# Altium project MMC_2_2.PrjPcb
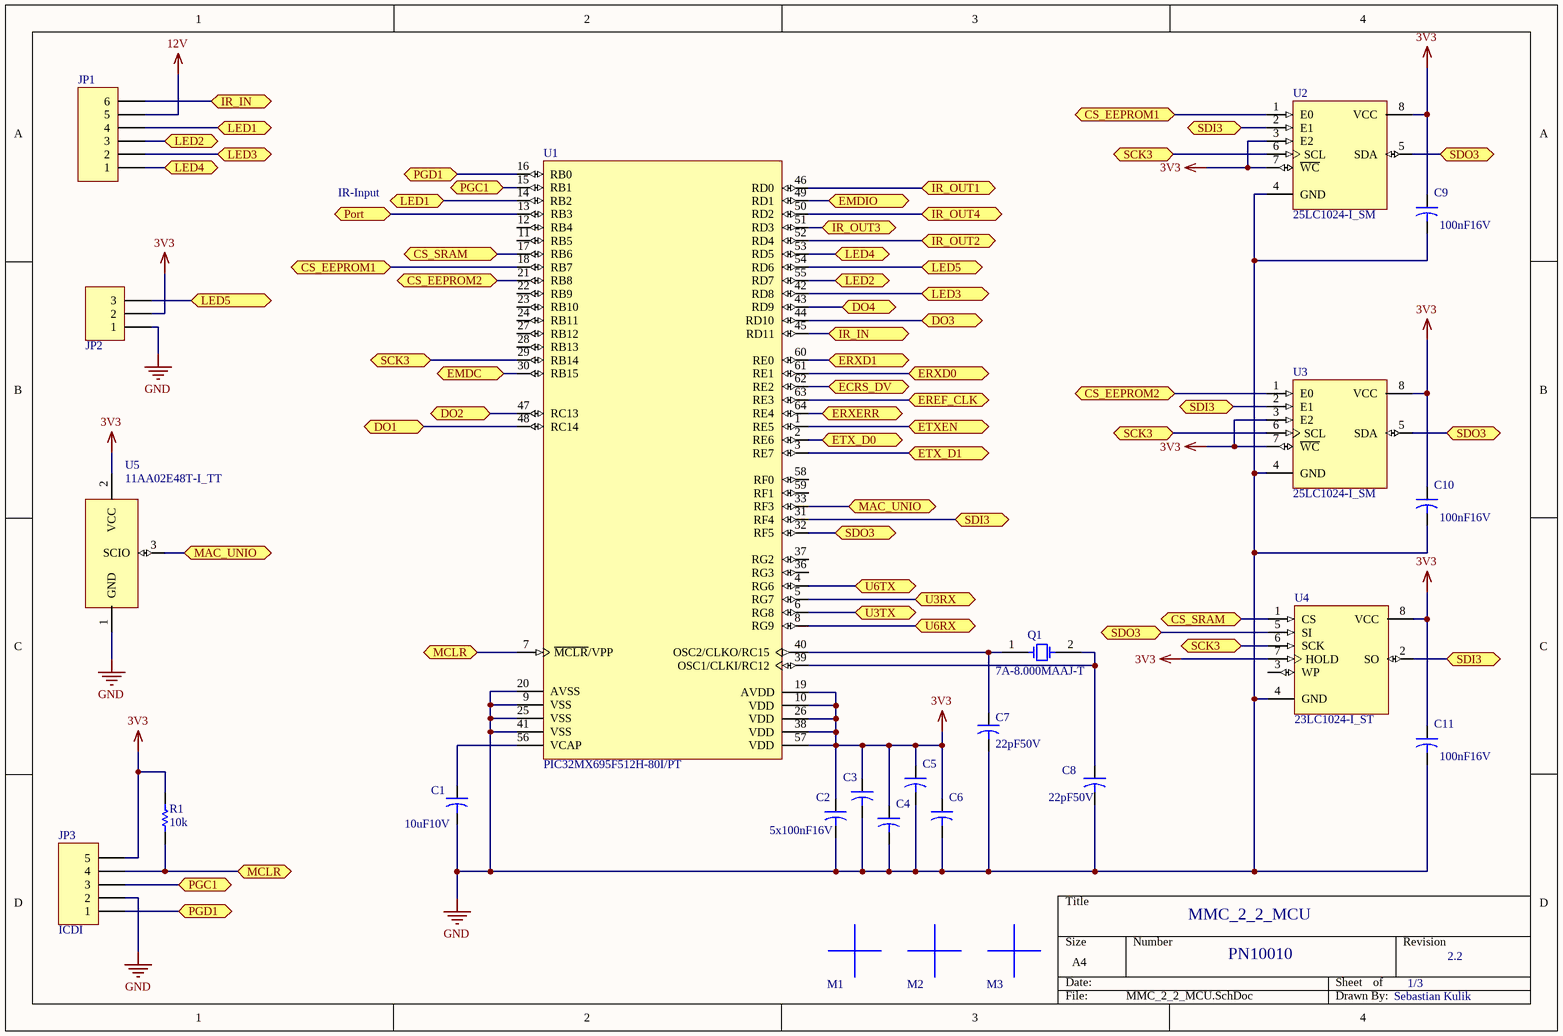
[diagram p0: MMC_2_2_MCU.SchDoc]
3 sheets, 83 parts. Net scope: flat (ports and power ports of the same name join across sheets).
Board file: MMC_2_2.PcbDoc
Sheets:
  MMC_2_2_MCU.SchDoc
  MMC_2_2_Ethernet.SchDoc
  MMC_2_2_PSU.SchDoc

## Sheet MMC_2_2_MCU.SchDoc
size A4

### Parts
C1  value 10uF10V  [C0603]  (hidden comment: 10uF10V_0603)
C2  100nF16V_0402  [C0402]  (value not drawn)
C3  100nF16V_0402  [C0402]  (value not drawn)
C4  100nF16V_0402  [C0402]  (value not drawn)
C5  100nF16V_0402  [C0402]  (value not drawn)
C6  100nF16V_0402  [C0402]  (value not drawn)
C7  value 22pF50V  [C0402]  (hidden comment: 22pF50V_0402)
C8  value 22pF50V  [C0402]  (hidden comment: 22pF50V_0402)
C9  value 100nF16V  [C0402]  (hidden comment: 100nF16V_0402)
C10  value 100nF16V  [C0402]  (hidden comment: 100nF16V_0402)
C11  value 100nF16V  [C0402]  (hidden comment: 100nF16V_0402)
JP1  Header 6_2.54  [HDR1X6_2.54]  (value not drawn)
JP2  Header-3  [HDR1X3]  (value not drawn)
JP3  ICDI  [HDR1X5-1.27]
M1  Mark  [Mark-3mm]  (value not drawn)
M2  Mark  [Mark-3mm]  (value not drawn)
M3  Mark  [Mark-3mm]  (value not drawn)
Q1  7A-8.000MAAJ-T  [TXC_7A]
R1  value 10k  [R0402]  (hidden comment: 10k_0402)
U1  PIC32MX695F512H-80I/PT  [TQFP-64_N1]
U2  25LC1024-I_SM  [SOP8_N]
U3  25LC1024-I_SM  [SOP8_N]
U4  23LC1024-I_ST  [TSSOP8]
U5  11AA02E48T-I_TT  [SOT23_M]

### Ports
CS_EEPROM1, CS_EEPROM2, CS_SRAM, DO1, DO2, DO3, DO4, ECRS_DV, EMDC, EMDIO, EREF_CLK, ERXD0, ERXD1, ERXERR, ETX_D0, ETX_D1, ETXEN, IR_IN, IR_OUT1, IR_OUT2, IR_OUT3, IR_OUT4, LED1, LED2, LED3, LED4, LED5, MAC_UNIO, MCLR, PGC1, PGD1, Port, SCK3, SDI3, SDO3, U3RX, U3TX, U6RX, U6TX

### Nets
3V3: C2.1 C3.1 C4.1 C5.1 C6.1 C9.1 C10.1 C11.1 JP2.2 JP3.5 R1.2 U1.10(VDD) U1.19(AVDD) U1.26(VDD) U1.38(VDD) U1.57(VDD) U2.3(E2) U2.7(~{WC}) U2.8(VCC) U3.3(E2) U3.7(~{WC}) U3.8(VCC) U4.7(HOLD) U4.8(VCC) U5.2(VCC)
12V: JP1.5
GND: C1.2 C2.2 C3.2 C4.2 C5.2 C6.2 C7.2 C8.2 C9.2 C10.2 C11.2 JP2.1 JP3.2 U1.9(VSS) U1.20(AVSS) U1.25(VSS) U1.41(VSS) U2.4(GND) U3.4(GND) U4.4(GND) U5.1(GND)
NetC1_1: C1.1 U1.56(VCAP)
NetC7_1: C7.1 Q1.1(E/D) U1.40(OSC2/CLKO/RC15)
NetC8_1: C8.1 Q1.2(GND) U1.39(OSC1/CLKI/RC12)
NetJP1_1: JP1.1 U1.53(RD5) ; port LED4
NetJP1_2: JP1.2 U1.42(RD8) ; port LED3
NetJP1_3: JP1.3 U1.55(RD7) ; port LED2
NetJP1_4: JP1.4 U1.14(RB2) ; port LED1
NetJP1_6: JP1.6 U1.45(RD11) ; port IR_IN
NetJP2_3: JP2.3 U1.54(RD6) ; port LED5
NetJP3_1: JP3.1 U1.16(RB0) ; port PGD1
NetJP3_3: JP3.3 U1.15(RB1) ; port PGC1
NetJP3_4: JP3.4 R1.1 U1.7(~{MCLR}/VPP) ; port MCLR
NetR2_2: U1.63(RE3) ; port EREF_CLK
NetR13_1: U1.49(RD1) ; port EMDIO
NetR15_2: U1.60(RE0) ; port ERXD1
NetR16_2: U1.61(RE1) ; port ERXD0
NetR17_2: U1.64(RE4) ; port ERXERR
NetR18_2: U1.62(RE2) ; port ECRS_DV
NetU1_1: U1.1(RE5) ; port ETXEN
NetU1_2: U1.2(RE6) ; port ETX_D0
NetU1_3: U1.3(RE7) ; port ETX_D1
NetU1_4: U1.4(RG6) ; port U6TX
NetU1_5: U1.5(RG7) ; port U3RX
NetU1_6: U1.6(RG8) ; port U3TX
NetU1_8: U1.8(RG9) ; port U6RX
NetU1_13: U1.13(RB3) ; port Port
NetU1_17: U1.17(RB6) U4.1(CS) ; port CS_SRAM
NetU1_18: U1.18(RB7) U2.1(E0) ; port CS_EEPROM1
NetU1_21: U1.21(RB8) U3.1(E0) ; port CS_EEPROM2
NetU1_29: U1.29(RB14) U2.6(SCL) U3.6(SCL) U4.6(SCK) ; port SCK3
NetU1_30: U1.30(RB15) ; port EMDC
NetU1_31: U1.31(RF4) U2.2(E1) U3.2(E1) U4.2(SO) ; port SDI3
NetU1_32: U1.32(RF5) U2.5(SDA) U3.5(SDA) U4.5(SI) ; port SDO3
NetU1_33: U1.33(RF3) U5.3(SCIO) ; port MAC_UNIO
NetU1_43: U1.43(RD9) ; port DO4
NetU1_44: U1.44(RD10) ; port DO3
NetU1_46: U1.46(RD0) ; port IR_OUT1
NetU1_47: U1.47(RC13) ; port DO2
NetU1_48: U1.48(RC14) ; port DO1
NetU1_50: U1.50(RD2) ; port IR_OUT4
NetU1_51: U1.51(RD3) ; port IR_OUT3
NetU1_52: U1.52(RD4) ; port IR_OUT2

Not connected (* = marked no-connect by the designer): U1 11(RB5) 12(RB4) 22(RB9) 23(RB10) 24(RB11) 27(RB12) 28(RB13) 36(RG3) 37(RG2) 58(RF0) 59(RF1); U4 3(WP)

### Notes on the sheet
- IR-Input
- (near C2) 5x100nF16V
- MMC_2_2_MCU
- PN10010
- 1/3
- 2.2
- Sebastian Kulik

### Library data of the parts
C1 = 10uF10V_0603: Capacitor; Part Description: AVX ,  X5R, 20%, 10V; Deliverer PartNr: 1867954RL; Manufacturer: AVX; Manufacturer PartNr: 0603ZD106MAT2A; Deliverer: Farnell; TDFE-PN: C0016; Published: 11.02.2014; Publisher: Sebastian Kulik; PackageDescription: C0603
C2-C6 C9-C11 = 100nF16V_0402: Capacitor; Part Description: TDK. CGA series, X7R, 10%, 16V; Deliverer PartNr: 2210748RL; Manufacturer: TDK; Manufacturer PartNr: CGA2B1X7R1C104K050BC; Deliverer: Farnell; TDFE-PN: C0025; Published: 12.02.2014; Publisher: Sebastian Kulik; PackageDescription: C0403
  C2-C6: Value: 100nF16V
C7 C8 = 22pF50V_0402: Murata, GRM series, 50V; Deliverer PartNr: 8819629RL; Manufacturer PartNr: GRM1555C1H220JZ01D; Deliverer: Farnell; TDFE-PN: C0021; Published: 11.02.2014; Part Description: Murata, GRM series, 50V; Publisher: Sebastian Kulik; PackageDescription: C0403; Manufacturer: Murata
JP1 = Header 6_2.54: Header, 6-Pin; LatestRevisionDate: 17-Jul-2002; LatestRevisionNote: Re-released for DXP Platform.; Publisher: Altium Limited
JP2 = Header-3: Header-3-Pin; Publisher: Sebastian Kulik
JP3 = ICDI: Header, 5-Pin; LatestRevisionDate: 17-Jul-2002; LatestRevisionNote: Re-released for DXP Platform.; Publisher: Sebastian Kulik
Q1 = Crystal_8MHz: Crystal, 7A-8.000MAAJ-T; Deliverer PartNr: 1892148; Manufacturer: TXC; Deliverer: Farnell; TDE-PN: P0003; Published: 14.02.2014; PackageReference: 7A; Publisher: Sebastian Kulik; Manufacturer PartNr: 7A-8.000MAAJ-T
R1 = 10k_0402: Vishay CRCW series, 125mW, 1%; Manufacturer PartNr: CRCW040210K0FKEAHP; Deliverer PartNr: 1738864; TDE-PN: R0012; Deliverer: Farnell; Published: 12.02.2014; PackageReference: 0402; Publisher: Sebastian Kulik; PackageDescription: 0402; Manufacturer: Vishay; Part Description: Vishay CRCW series, 125mW, 1%
U1 = PIC32MX695F512H-80I/PT: High Performance ROM-less Microcontroller with External Memory Bus, 1.5K RAM, 64-Pin TQFP, 4.2 to 5.5V Supply Range, Industrial Temperature; Deliverer PartNr: 1778975; Manufacturer: Microchip; Deliverer: Farnell; TDE-PN: IC0031; Published: 11.02.2014; PackageReference: TQFP-64; Publisher: Sebastian Kulik; PackageDescription: 64-Pin Thin Plastic Quad Flat Pack 0.5 mm Pitch, 1.0/0.1 mm Lead Form; Manufacturer PartNr: PIC32MX695F512H-80I/PT
U2 U3 = 25LC1024-I_SM: 1024 Kbit Serial SPI Bus EEPROM; Deliverer PartNr: 1331393; Manufacturer: Microchip; Deliverer: Farnell; TDE-PN: IC0033; Published: 12.02.2014; PackageReference: SOP8; Publisher: Sebastian Kulik; Manufacturer PartNr: 25LC1024-I_SM
U4 = 23LC1024-I_ST: 1 Mbit Serial  EEPROM; Deliverer PartNr: 2212151; Manufacturer PartNr: 23LC1024-I/ST; Manufacturer: Microchip; Deliverer: Farnell; TDE-PN: IC0034; Published: 12.02.2014; PackageReference: TSSOP8; Publisher: Sebastian Kulik
U5 = 11AA02E48T-I_TT: 2 kbit Serial  EEPROM; Deliverer PartNr: 1707616RL; Manufacturer PartNr: 11AA02E48T-I/TT; Manufacturer: Microchip; Deliverer: Farnell; TDE-PN: IC0035; Published: 12.02.2014; PackageReference: SOT23; Publisher: Sebastian Kulik

## Sheet MMC_2_2_Ethernet.SchDoc
size A4
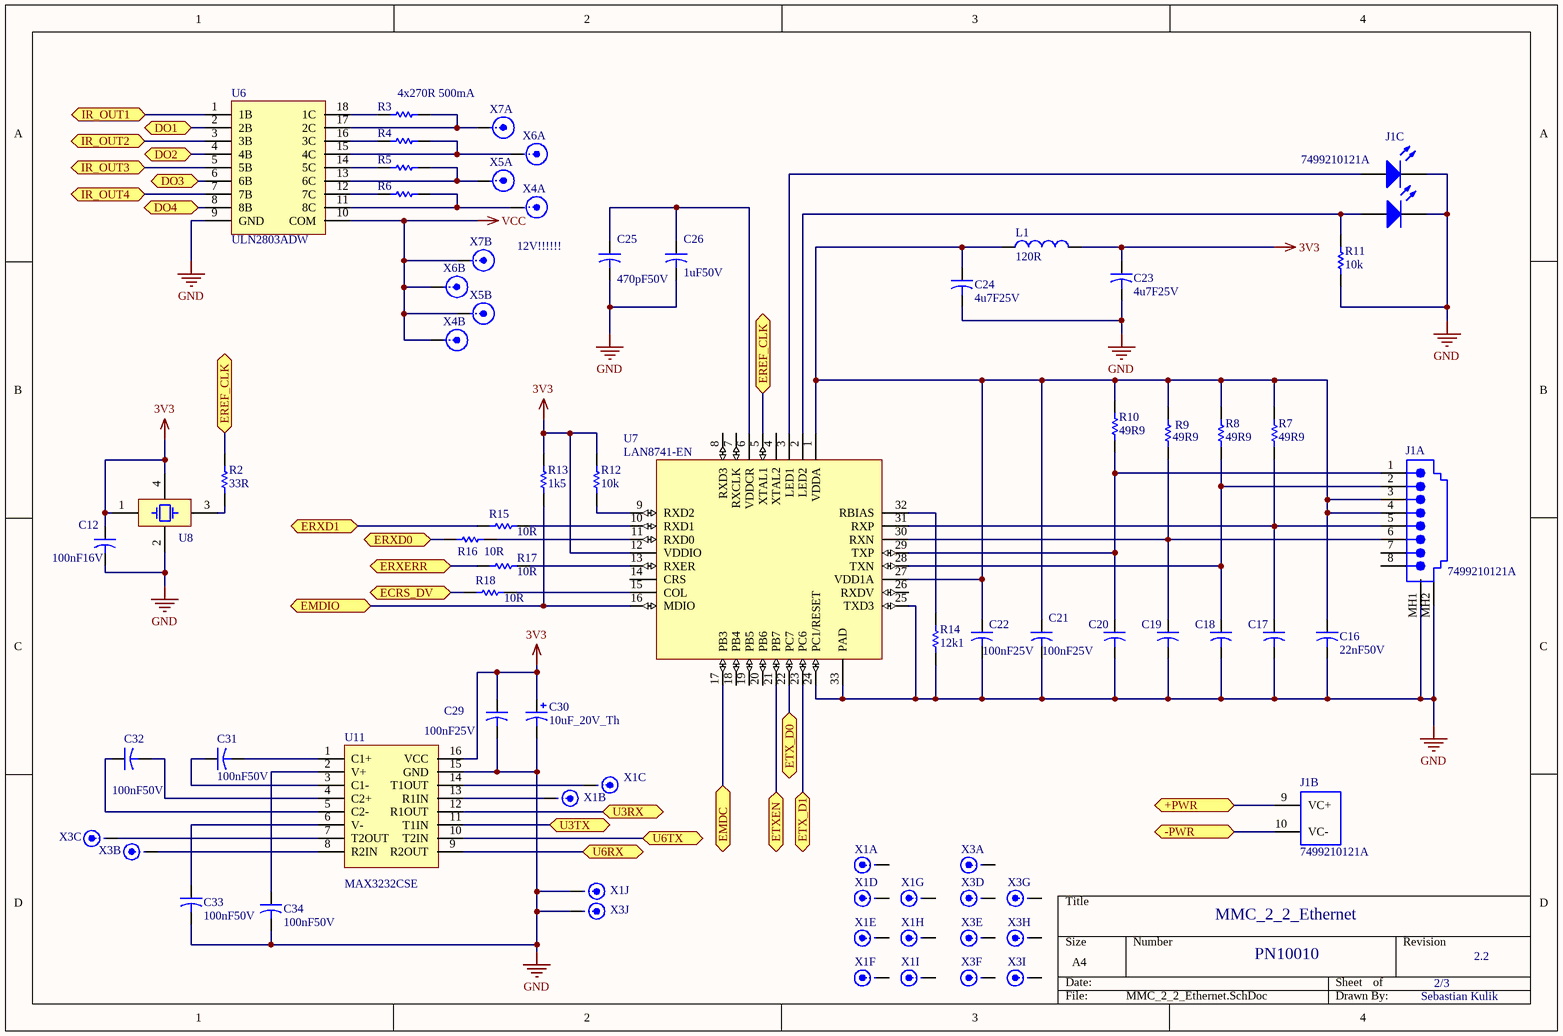
[diagram p1: MMC_2_2_Ethernet.SchDoc]

### Parts
C12  value 100nF16V  [C0402]  (hidden comment: 100nF16V_0402)
C16  value 22nF50V  [C0603]  (hidden comment: 22nF50V_0603)
C17  10pF50V_0603  [C0603]  (value not drawn)
C18  10pF50V_0603  [C0603]  (value not drawn)
C19  10pF50V_0603  [C0603]  (value not drawn)
C20  10pF50V_0603  [C0603]  (value not drawn)
C21  value 100nF25V  [C0402]  (hidden comment: 100nF25V_0402)
C22  value 100nF25V  [C0402]  (hidden comment: 100nF25V_0402)
C23  value 4u7F25V  [C0805]  (hidden comment: 4u7F25V_0805)
C24  value 4u7F25V  [C0805]  (hidden comment: 4u7F25V_0805)
C25  value 470pF50V  [C0402]  (hidden comment: 470pF50V_0402)
C26  value 1uF50V  [C0603]  (hidden comment: 1uF50V_0603)
C29  value 100nF25V  [C0402]  (hidden comment: 100nF25V_0402)
C30  value 10uF_20V_Th  [Vishay293D-B]  (hidden comment: 10uF_20V_V293D-B)
C31  value 100nF50V  [C0402]  (hidden comment: 100n50V_0402)
C32  value 100nF50V  [C0402]  (hidden comment: 100n50V_0402)
C33  value 100nF50V  [C0402]  (hidden comment: 100n50V_0402)
C34  value 100nF50V  [C0402]  (hidden comment: 100n50V_0402)
J1  7499210121A  [7499210121A]  (parts A,B,C of 3)
L1  value 120R  [L0603]  (hidden comment: 120R4A_0603)
R2  value 33R  [R0402]  (hidden comment: 33R_0402)
R3  270R_1210  [R1210_N]  (value not drawn)
R4  270R_1210  [R1210_N]  (value not drawn)
R5  270R_1210  [R1210_N]  (value not drawn)
R6  270R_1210  [R1210_N]  (value not drawn)
R7  value 49R9  [R0402]  (hidden comment: 49R9_0402)
R8  value 49R9  [R0402]  (hidden comment: 49R9_0402)
R9  value 49R9  [R0402]  (hidden comment: 49R9_0402)
R10  value 49R9  [R0402]  (hidden comment: 49R9_0402)
R11  value 10k  [R0402]  (hidden comment: 10k_0402)
R12  value 10k  [R0402]  (hidden comment: 10k_0402)
R13  value 1k5  [R0402]  (hidden comment: 1k5_0402)
R14  value 12k1  [R0603(1608)]  (hidden comment: 12k1_0603)
R15  value 10R  [R0402]  (hidden comment: 10R_0402)
R16  value 10R  [R0402]  (hidden comment: 10R_0402)
R17  value 10R  [R0402]  (hidden comment: 10R_0402)
R18  value 10R  [R0402]  (hidden comment: 10R_0402)
U6  ULN2803ADW  [SOIC18-WIDE]
U7  LAN8741-EN  [32M1-A_M]
U8  TXC-7W-50.000MBB-T  [TXC_7W]  (value not drawn)
U11  MAX3232CSE  [SOIC16_L]
X1  SUB-D_9  [M09HP]  (value not drawn)  (parts A,B,C,D,E,F,G,H,I,J of 10)
X3  SUB-D_9  [M09HP]  (value not drawn)  (parts A,B,C,D,E,F,G,H,I,J of 10)
X4  PhoenixMSTBA-2  [MSTBA 2,5_2-G-5,08-LR]  (value not drawn)  (parts A,B of 2)
X5  PhoenixMSTBA-2  [MSTBA 2,5_2-G-5,08-LR]  (value not drawn)  (parts A,B of 2)
X6  PhoenixMSTBA-2  [MSTBA 2,5_2-G-5,08-LR]  (value not drawn)  (parts A,B of 2)
X7  PhoenixMSTBA-2  [MSTBA 2,5_2-G-5,08-LR]  (value not drawn)  (parts A,B of 2)

### Ports
+PWR, -PWR, DO1, DO2, DO3, DO4, ECRS_DV, EMDC, EMDIO, EREF_CLK, ERXD0, ERXD1, ERXERR, ETX_D0, ETX_D1, ETXEN, IR_OUT1, IR_OUT2, IR_OUT3, IR_OUT4, U3RX, U3TX, U6RX, U6TX

### Nets
3V3: C12.1 C23.1 C29.1 C30.1 L1.2 R12.2 R13.2 U7.12(VDDIO) U8.1(E/D) U8.4(VCC) U11.16(VCC)
GND: C12.2 C16.2 C17.2 C18.2 C19.2 C20.2 C21.2 C22.2 C23.2 C24.2 C25.2 C26.2 C29.2 C30.2 C33.2 C34.2 J1.12(K) J1.14(K) J1.MH1(Shield) J1.MH2(Shield) R11.1 R14.1 U6.9(GND) U7.24(PC1/RESET) U7.25(TXD3) U7.33(PAD) U8.2(GND) U11.15(GND) X1.10(GND) X3.10(GND)
VCC: U6.10(COM) X4.2(Y) X5.2(Y) X6.2(Y) X7.2(Y)
NetC16_1: C16.1 C21.1 C22.1 C24.1 J1.3 J1.4 L1.1 R7.2 R8.2 R9.2 R10.2 U7.1(VDDA) U7.27(VDD1A)
NetC17_1: C17.1 J1.5 R7.1 U7.31(RXP)
NetC18_1: C18.1 J1.2 R8.1 U7.28(TXN)
NetC19_1: C19.1 J1.6 R9.1 U7.30(RXN)
NetC20_1: C20.1 J1.1 R10.1 U7.29(TXP)
NetC25_1: C25.1 C26.1 U7.6(VDDCR)
NetC31_1: C31.1 U11.3(C1-)
NetC31_2: C31.2 U11.1(C1+)
NetC32_1: C32.1 U11.5(C2-)
NetC32_2: C32.2 U11.4(C2+)
NetC33_1: C33.1 U11.6(V-)
NetC34_1: C34.1 U11.2(V+)
NetD3_1: J1.9(VC+) ; port +PWR
NetD3_2: J1.10(VC-) ; port -PWR
NetJ1_11: J1.11(A) U7.3(LED1)
NetJ1_13: J1.13(A) R11.2 U7.2(LED2)
NetR2_1: R2.1 U8.3(OSC2)
NetR2_2: R2.2 U7.5(XTAL1) ; port EREF_CLK
NetR3_1: R3.1 U6.18(1C)
NetR3_2: R3.2 U6.17(2C) X7.1(X)
NetR4_1: R4.1 U6.16(3C)
NetR4_2: R4.2 U6.15(4C) X6.1(X)
NetR5_1: R5.1 U6.14(5C)
NetR5_2: R5.2 U6.13(6C) X5.1(X)
NetR6_1: R6.1 U6.12(7C)
NetR6_2: R6.2 U6.11(8C) X4.1(X)
NetR12_1: R12.1 U7.9(RXD2)
NetR13_1: R13.1 U7.16(MDIO) ; port EMDIO
NetR14_2: R14.2 U7.32(RBIAS)
NetR15_1: R15.1 U7.10(RXD1)
NetR15_2: R15.2 ; port ERXD1
NetR16_1: R16.1 U7.11(RXD0)
NetR16_2: R16.2 ; port ERXD0
NetR17_1: R17.1 U7.13(RXER)
NetR17_2: R17.2 ; port ERXERR
NetR18_1: R18.1 U7.15(COL)
NetR18_2: R18.2 ; port ECRS_DV
NetU1_1: U7.21(PB7) ; port ETXEN
NetU1_2: U7.22(PC7) ; port ETX_D0
NetU1_3: U7.23(PC6) ; port ETX_D1
NetU1_4: U11.10(T2IN) ; port U6TX
NetU1_5: U11.12(R1OUT) ; port U3RX
NetU1_6: U11.11(T1IN) ; port U3TX
NetU1_8: U11.9(R2OUT) ; port U6RX
NetU1_30: U7.17(PB3) ; port EMDC
NetU1_43: U6.8(8B) ; port DO4
NetU1_44: U6.6(6B) ; port DO3
NetU1_46: U6.1(1B) ; port IR_OUT1
NetU1_47: U6.4(4B) ; port DO2
NetU1_48: U6.2(2B) ; port DO1
NetU1_50: U6.7(7B) ; port IR_OUT4
NetU1_51: U6.5(5B) ; port IR_OUT3
NetU1_52: U6.3(3B) ; port IR_OUT2
NetU11_7: U11.7(T2OUT) X3.3
NetU11_8: U11.8(R2IN) X3.2
NetU11_13: U11.13(R1IN) X1.2
NetU11_14: U11.14(T1OUT) X1.3

Not connected (* = marked no-connect by the designer): J1 7 8; U7 4(XTAL2) 7(RXCLK) 8(RXD3) 14(CRS) 18(PB4) 19(PB5) 20(PB6) 26(RXDV); X1 1 4 5 6 7 8 9; X3 1 4 5 6 7 8 9

### Notes on the sheet
- (near R3) 4x270R 500mA
- 12V!!!!!!
- MMC_2_2_Ethernet
- PN10010
- 2/3
- 2.2
- Sebastian Kulik

### Library data of the parts
C12 = 100nF16V_0402: as C2 on sheet MMC_2_2_MCU; Published: 12.02.2014; Publisher: Sebastian Kulik; PackageDescription: C0403
C16 = 22nF50V_0603: AVX ,  X7R, 5%, 50V; Deliverer PartNr: 2332645RL; Manufacturer PartNr: 06035C223JAT2A; Deliverer: Farnell; TDFE-PN: C0034; Published: 13.02.2014; Part Description: AVX ,  X7R, 5%, 50V; Publisher: Sebastian Kulik; PackageDescription: C0603; Manufacturer: AVX
C17-C20 = 10pF50V_0603: AVX ,  +-0.5pF, 50V; Deliverer PartNr: 2332595RL; Manufacturer PartNr: 06035A100DAT2A; Deliverer: Farnell; TDFE-PN: C0033; Published: 13.02.2014; Part Description: AVX ,  +-0.5pF, 50V; Publisher: Sebastian Kulik; PackageDescription: C0603; Manufacturer: AVX; Value: 10pF50V
C21 C22 C29 = 100nF25V_0402: AVX, X5R, 10%, 25V; Deliverer PartNr: 2280767; Manufacturer PartNr: 04023D104KAT2A; Deliverer: Farnell; TDFE-PN: C0036; Published: 13.02.2014; Part Description: AVX, X5R, 10%, 25V; Publisher: Sebastian Kulik; PackageDescription: C0403; Manufacturer: AVX
C23 C24 = 4u7F25V_0805: TDK  C series, X7R, 10%, 25V; Deliverer PartNr: 2346943RL; Manufacturer PartNr: C2012X7R1E475K125AB; Deliverer: Farnell; TDFE-PN: C0035; Published: 13.02.2014; Part Description: TDK  C series, X7R, 10%, 25V; Publisher: Sebastian Kulik; PackageDescription: C0805; Manufacturer: TDK
C25 = 470pF50V_0402: AVX, 50V; Deliverer PartNr: 1657927; Manufacturer PartNr: 04025A471JAT2A; Deliverer: Farnell; TDFE-PN: C0030; Published: 13.02.2014; Part Description: AVX,50V; Publisher: Sebastian Kulik; PackageDescription: C0403; Manufacturer: AVX
C26 = 1uF50V_0603: C series, X5R, 10%; Deliverer PartNr: 2211179RL; Manufacturer: TDK; Manufacturer PartNr: C1608X5R1H105K080AB; Deliverer: Farnell; TDFE-PN: C0037; Published: 13.02.2014; Part Description: C series, X5R, 10%; Publisher: Sebastian Kulik; PackageDescription: C0603
C30 = 10uF_20V_V293D-B: 293 series, tantal, 10%, 10V; Part Description: 293 series, tantal, 10%, 20V; Deliverer PartNr: 1754203; Manufacturer: Vishay; Manufacturer PartNr: 293D106X9020B2TE3; Deliverer: Farnell; TDFE-PN: C0043; Published: 14.03.2014; Publisher: Sebastian Kulik; PackageDescription: Vishay-293D-B
C31-C34 = 100n50V_0402: C series, X5R, 10%, 50V; Deliverer PartNr: 2354078; Manufacturer: TDK; Manufacturer PartNr: C1005X5R1H104K050BB; Deliverer: Farnell; TDFE-PN: C0044; Published: 13.02.2014; Part Description: C series, X5R, 10%, 50V; Publisher: Sebastian Kulik; PackageDescription: C0403
J1 = Ethernet, POE, WE7499210121A: Modular Jack , Right Angle RJ-45, Low Profile; Deliverer PartNr: 1636396; Manufacturer: Wuerth Elektronik; Ports: 1; PCB_Mounting: Thru-Hole; Deliverer: Farnell; TDE-PN: CON0005; PackageReference: 7499210121A; Publisher: Sebastian Kulik; Manufacturer PartNr: 7499210121A
L1 = 120R4A_0603: Murata, Ferrit, 120Rx2A; Deliverer PartNr: 1515738RL; Manufacturer PartNr: BLM18PG121SN1D; Deliverer: Farnell; TDE-PN: P0016; Manufacturer: Murata; Published: 13.02.2014; Publisher: Sebastian Kulik
R2 = 33R_0402: Vishay CRCW series, 63mW, 1%; Manufacturer PartNr: CRCW040233R0FKEAHP; Deliverer PartNr: 1738830; TDE-PN: R0037; Deliverer: Farnell; Published: 12.02.2014; PackageReference: 0402; Publisher: Sebastian Kulik; PackageDescription: 0402; Manufacturer: Vishay; Part Description: Vishay CRCW series, 63mW, 1%
R3-R6 = 270R_1210: ERJ series, 500mW, 5%; Manufacturer: Panasonic; Manufacturer PartNr: ERJ14YJ271U; Deliverer PartNr: 2324044; TDE-PN: R0042; Deliverer: Farnell; Value: 270R; Published: 13.03.2014; PackageReference: 1210; Publisher: Sebastian Kulik; PackageDescription: 1210; Part Description: ERJ series, 500mW, 5%
R7-R10 = 49R9_0402: Vishay CRCW series, 63mW, 1%; Manufacturer PartNr: CRCW040249R9FKED; Deliverer PartNr: 2121437; TDE-PN: R0035; Deliverer: Farnell; Published: 13.02.2014; PackageReference: 0402; Publisher: Sebastian Kulik; PackageDescription: 0402; Manufacturer: Vishay; Part Description: Vishay CRCW series, 63mW, 1%
R11 R12 = 10k_0402: as R1 on sheet MMC_2_2_MCU; Published: 12.02.2014; PackageReference: 0402; Publisher: Sebastian Kulik; PackageDescription: 0402; Manufacturer: Vishay; Part Description: Vishay CRCW series, 125mW, 1%
R13 = 1k5_0402: Vishay CRCW series, 125mW, 1%; Manufacturer PartNr: CRCW04021K50FKEAHP; Deliverer PartNr: 1738852; Part Description: Vishay CRCW series, 63mW, 1%; TDE-PN: R0036; Deliverer: Farnell; Published: 13.02.2014; PackageReference: 0402; Publisher: Sebastian Kulik; PackageDescription: 0402; Manufacturer: Vishay
R14 = 12k1_0603: Vishay, CRCW series, 100mW, 1%; Manufacturer PartNr: CRCW060312K1FKEA; Deliverer PartNr: 2122502; TDE-PN: R0037; Deliverer: Farnell; Published: 11.02.2014; Publisher: Sebastian Kulik; PackageDescription: 0603; Manufacturer: Vishay; Part Desicription: Vishay, CRCW series, 100mW, 1%
R15-R18 = 10R_0402: Vishay CRCW series, 125mW, 1%; Manufacturer PartNr: CRCW040210R0FKEAHP; Deliverer PartNr: 1738824RL; TDE-PN: R0015; Deliverer: Farnell; Published: 12.02.2014; PackageReference: 0402; Publisher: Sebastian Kulik; PackageDescription: 0402; Manufacturer: Vishay; Part Description: Vishay CRCW series, 125mW, 1%
U6 = ULN2803ADW: Darlington array, 50V; Deliverer PartNr: 1652419; Manufacturer: TI; Deliverer: Farnell; TDE-PN: IC0043; Published: 13.03.2014; PackageReference: TSSOP18; Publisher: Sebastian Kulik; Manufacturer PartNr: ULN2803ADW
U7 = LAN8741-EN: Ethernet Phy; Deliverer PartNr: 2373284; Manufacturer PartNr: LAN8741A-EN; Manufacturer: Microchip; TDE-PN: IC0036; Deliverer: Farnell; Published: 12.02.2014; LatestRevisionNote: IPC-7351 Footprint Added.; Publisher: Sebastian Kulik
U8 = TXC-7W-50.000MBB-T: Crystal; Deliverer PartNr: 1842144; Manufacturer: TXC; Deliverer: Farnell; TDE-PN: IC0037; Published: 17.02.2014; PackageReference: SOT23; Publisher: Sebastian Kulik; Manufacturer PartNr: 7W-50.000MBB-T
U11 = MAX3232CSE: RS232 transceiver; Deliverer PartNr: 9725490; Manufacturer PartNr: MAX3232CSE+; Manufacturer: Maxim; Deliverer: Farnell; TDE-PN: IC0044; Published: 14.03.2014; PackageReference: TSSOP16; Publisher: Sebastian Kulik
X1 X3 = SUB-D_9: Deliverer PartNr: 8391246; Manufacturer PartNr: 1-1634580-2; Manufacturer: AMP; Deliverer: Farnell; TDE-PN: CON0007; LatestRevisionDate: 14.03.2014; LatestRevisionNote: Re-released for DXP Platform.; Publisher: Sebastian Kulik
X4-X7 = PhoenixMSTBA-2: Deliverer PartNr: 2315182; Manufacturer PartNr: MSTBA 2,5/ 2-G-5,08-LR; Manufacturer: Phoenix Contact; Deliverer: Farnell; TDE-PN: CON0006; LatestRevisionDate: 13.03.2014; LatestRevisionNote: Re-released for DXP Platform.; Publisher: Sebastian Kulik

## Sheet MMC_2_2_PSU.SchDoc
size A4
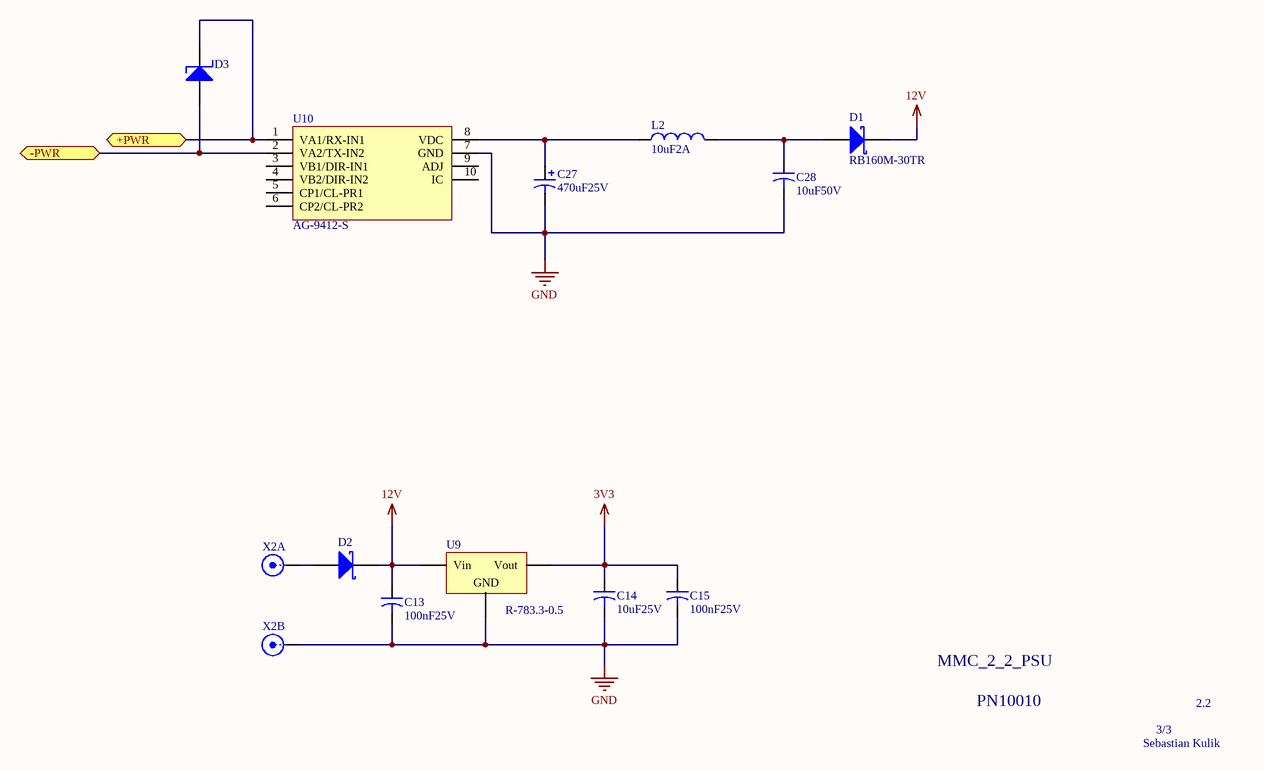
[diagram p2: MMC_2_2_PSU.SchDoc]

### Parts
C13  value 100nF25V  [C0402]  (hidden comment: 100nF25V_0402)
C14  value 10uF25V  [C1210]  (hidden comment: 10uF25V_1210)
C15  value 100nF25V  [C0402]  (hidden comment: 100nF25V_0402)
C27  value 470uF25V  [Panasonic-H13]  (hidden comment: 470uF25V_POL)
C28  value 10uF50V  [C1210]  (hidden comment: 10uF50V_1210)
D1  RB160M-30TR  [SOD123]
D2  SD103AW-V-GS08  [SOD123]  (value not drawn)
D3  SMAJ58A-E3/61  [DO214A]  (value not drawn)
L2  10uF2A  [WE-PD2_1]
U9  R-783.3-0.5  [R-783_3-0_5]
U10  AG-9412-S  [AG-9412-S-1]
X2  PhoenixMSTBA-2  [MSTBA 2,5_2-G-5,08-LR]  (value not drawn)  (parts A,B of 2)

### Ports
+PWR, -PWR

### Nets
3V3: C14.1 C15.1 U9.3(Vout)
12V: C13.1 D1.1(K) D2.1(K) U9.1(Vin)
GND: C13.2 C14.2 C15.2 C27.2 C28.2 U9.2(GND) U10.7(GND) X2.2(Y)
NetC27_1: C27.1 L2.1 U10.8(VDC)
NetC28_1: C28.1 D1.2(A) L2.2
NetD2_2: D2.2(A) X2.1(X)
NetD3_1: D3.1(K) U10.1(VA1/RX-IN1) ; port +PWR
NetD3_2: D3.2(A) U10.2(VA2/TX-IN2) ; port -PWR

Not connected (* = marked no-connect by the designer): U10 3(VB1/DIR-IN1) 4(VB2/DIR-IN2) 5(CP1/CL-PR1) 6(CP2/CL-PR2) 9(ADJ) 10(IC)

### Notes on the sheet
- MMC_2_2_PSU
- PN10010
- 3/3
- 2.2
- Sebastian Kulik

### Library data of the parts
C13 C15 = 100nF25V_0402: as C21 on sheet MMC_2_2_Ethernet; Published: 13.02.2014; Part Description: AVX, X5R, 10%, 25V; Publisher: Sebastian Kulik; PackageDescription: C0403; Manufacturer: AVX
C14 = 10uF25V_1210: Capacitor; Part Description: TDK  C series, X5R, 10%, 25V; Deliverer PartNr: 2346957; Manufacturer: TDK; Manufacturer PartNr: C3225X5R1E106K250AA; Deliverer: Farnell; TDFE-PN: C0014; Published: 12.02.2014; Publisher: Sebastian Kulik; PackageDescription: C1210
C27 = 470uF25V_POL: Panasonic, TG series; Deliverer PartNr: 2282114; Manufacturer PartNr: EEV-TG1E471Q; Deliverer: Farnell; TDFE-PN: C0038; Published: 17.02.2014; Part Description: Panasonic, TG series; Publisher: Sebastian Kulik; Manufacturer: Panasonic
C28 = 10uF50V_1210: AVX,  X7R, 10%, 50V; Deliverer PartNr: 2094047RL; Manufacturer PartNr: 12105C106KAT2A; Deliverer: Farnell; TDFE-PN: C0039; Published: 17.02.2014; Part Description: AVX,  X7R, 10%, 50V; Publisher: Sebastian Kulik; PackageDescription: C1210; Manufacturer: AVX
D1 = RB160M-30TR: Diode Schottky,2A,40V; Deliverer PartNr: 1525480; Manufacturer: Rohm; TDE-PN: DIS0010; Deliverer: Farnell; Published: 17.02.2014; PackageReference: SOD123; Publisher: Sebastian Kulik; PackageDescription: SOD123; Manufacturer PartNr: RB160M-30TR
D2 = SD103AW-V-GS08: Diode Schottky,2A,40V; Deliverer PartNr: 1617720RL; Manufacturer: Vishay; TDE-PN: DIS0008; Deliverer: Farnell; Published: 12.02.2014; PackageReference: TO-220AC; Publisher: Sebastian Kulik; PackageDescription: SOD123; Manufacturer PartNr: SD103AW-V-GS08
D3 = SMAJ58A-E3/61: TVS, 400W, 58V; Deliverer PartNr: 1837053; Manufacturer: Vishay; TDE-PN: DIS0009; Deliverer: Farnell; Published: 17.02.2014; PackageReference: DO214AC; Publisher: Sebastian Kulik; PackageDescription: DO214AC; Manufacturer PartNr: SMAJ58A-E3/61
L2 = 10uF2A_WE-PD2: WE-PD2, 10uF2A; Deliverer PartNr: 1636035; Manufacturer: WE; Manufacturer PartNr: 74477510; Deliverer: Farnell; TDE-PN: P0017; Published: 17.02.2014; Publisher: Sebastian Kulik; Value: 10uF2A
U9 = Recom-R-783_3-0_5: Voltage Regulator; Manufacturer: Recom; Deliverer PartNr: 532-8044; TDE-PN: IC0032; Deliverer: RS-Components; Published: 12.02.2014; Manufacturer PartNr: R-783.3-0.5; PackageReference: D2PAK; Publisher: Sebastian Kulik
U10 = AG-9412-S: PoE, 12V; Manufacturer: Silvertel; TDE-PN: IC0038; Published: 17.02.2014; Deliverer PartNr: -; Deliverer: -; PackageReference: TSSOP8; Publisher: Sebastian Kulik; Manufacturer PartNr: AG-9412-S
X2 = PhoenixMSTBA-2: as X4 on sheet MMC_2_2_Ethernet; LatestRevisionDate: 13.03.2014; LatestRevisionNote: Re-released for DXP Platform.; Publisher: Sebastian Kulik

## Nets that join several sheets
3V3: MMC_2_2_MCU (25 pins), MMC_2_2_Ethernet (11 pins), MMC_2_2_PSU (C14.1 C15.1 U9.3)
12V: MMC_2_2_MCU (JP1.5), MMC_2_2_PSU (C13.1 D1.1 D2.1 U9.1)
GND: MMC_2_2_MCU (21 pins), MMC_2_2_Ethernet (30 pins), MMC_2_2_PSU (8 pins)
NetD3_1: MMC_2_2_Ethernet (J1.9), MMC_2_2_PSU (D3.1 U10.1)
NetD3_2: MMC_2_2_Ethernet (J1.10), MMC_2_2_PSU (D3.2 U10.2)
NetR2_2: MMC_2_2_MCU (U1.63), MMC_2_2_Ethernet (R2.2 U7.5)
NetR13_1: MMC_2_2_MCU (U1.49), MMC_2_2_Ethernet (R13.1 U7.16)
NetR15_2: MMC_2_2_MCU (U1.60), MMC_2_2_Ethernet (R15.2)
NetR16_2: MMC_2_2_MCU (U1.61), MMC_2_2_Ethernet (R16.2)
NetR17_2: MMC_2_2_MCU (U1.64), MMC_2_2_Ethernet (R17.2)
NetR18_2: MMC_2_2_MCU (U1.62), MMC_2_2_Ethernet (R18.2)
NetU1_1: MMC_2_2_MCU (U1.1), MMC_2_2_Ethernet (U7.21)
NetU1_2: MMC_2_2_MCU (U1.2), MMC_2_2_Ethernet (U7.22)
NetU1_3: MMC_2_2_MCU (U1.3), MMC_2_2_Ethernet (U7.23)
NetU1_4: MMC_2_2_MCU (U1.4), MMC_2_2_Ethernet (U11.10)
NetU1_5: MMC_2_2_MCU (U1.5), MMC_2_2_Ethernet (U11.12)
NetU1_6: MMC_2_2_MCU (U1.6), MMC_2_2_Ethernet (U11.11)
NetU1_8: MMC_2_2_MCU (U1.8), MMC_2_2_Ethernet (U11.9)
NetU1_30: MMC_2_2_MCU (U1.30), MMC_2_2_Ethernet (U7.17)
NetU1_43: MMC_2_2_MCU (U1.43), MMC_2_2_Ethernet (U6.8)
NetU1_44: MMC_2_2_MCU (U1.44), MMC_2_2_Ethernet (U6.6)
NetU1_46: MMC_2_2_MCU (U1.46), MMC_2_2_Ethernet (U6.1)
NetU1_47: MMC_2_2_MCU (U1.47), MMC_2_2_Ethernet (U6.4)
NetU1_48: MMC_2_2_MCU (U1.48), MMC_2_2_Ethernet (U6.2)
NetU1_50: MMC_2_2_MCU (U1.50), MMC_2_2_Ethernet (U6.7)
NetU1_51: MMC_2_2_MCU (U1.51), MMC_2_2_Ethernet (U6.5)
NetU1_52: MMC_2_2_MCU (U1.52), MMC_2_2_Ethernet (U6.3)

## Assembly variants
MMC_2_2_PoE: all parts fitted
MMC_2_2: not fitted C27 C28 D1 L2 U10